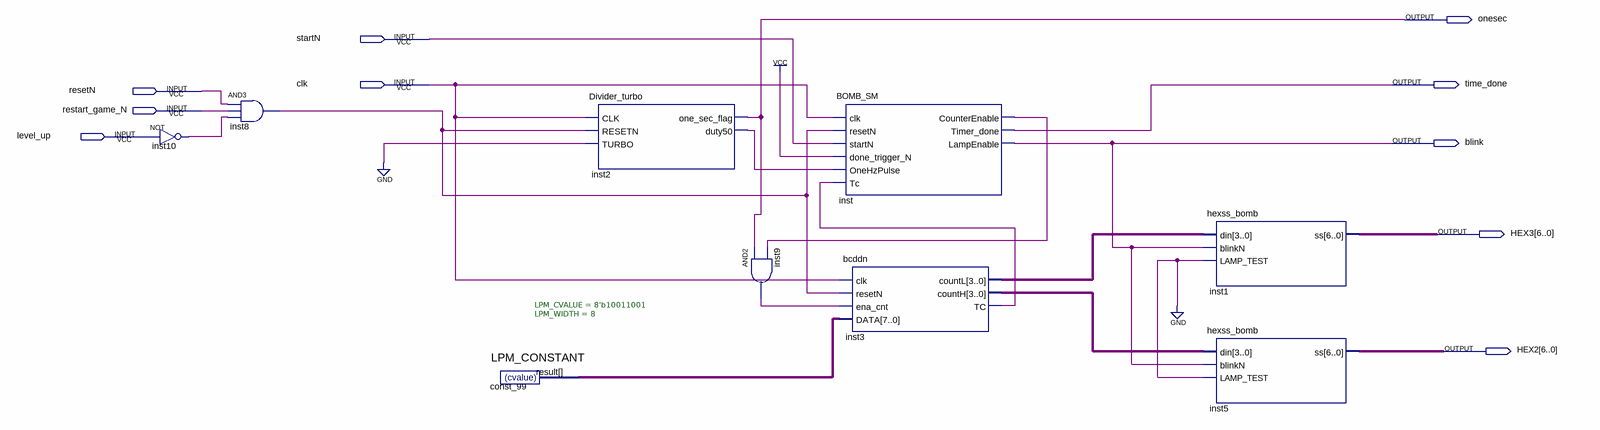
[diagram p0: schematic sheet]
// Quartus schematic BOMB_top.bdf as structural Verilog: 9 symbols, 10 pins
module BOMB_top (
  input  startN,
  input  clk,
  input  resetN,
  input  restart_game_N,
  input  level_up,
  output onesec,
  output time_done,
  output blink,
  output [6:0] HEX3,
  output [6:0] HEX2
);

  wire inst2_duty50, inst3_tc, inst8_out, inst9_out, inst10_out, inst_counterenable;
  wire [3:0] inst3_counth, inst3_countl;
  wire [7:0] const_99_result;

  not inst10 (inst10_out, level_up);
  and inst8 (inst8_out, resetN, restart_game_N, inst10_out);
  LPM_CONSTANT #(.LPM_CVALUE(8'b10011001), .LPM_WIDTH(8)) const_99 (.result(const_99_result));
  Divider_turbo inst2 (.CLK(clk), .RESETN(inst8_out), .TURBO(1'b0), .one_sec_flag(onesec), .duty50(inst2_duty50));
  and inst9 (inst9_out, onesec, inst_counterenable);
  BOMB_SM inst (
    .clk(clk), .resetN(inst8_out), .startN(startN), .done_trigger_N(1'b1), .OneHzPulse(inst2_duty50),
    .Tc(inst3_tc), .CounterEnable(inst_counterenable), .Timer_done(time_done), .LampEnable(blink));
  bcddn inst3 (
    .clk(clk), .resetN(inst8_out), .ena_cnt(inst9_out), .DATA(const_99_result), .countL(inst3_countl),
    .countH(inst3_counth), .TC(inst3_tc));
  hexss_bomb inst1 (.din(inst3_countl), .blinkN(blink), .LAMP_TEST(1'b0), .ss(HEX3));
  hexss_bomb inst5 (.din(inst3_counth), .blinkN(blink), .LAMP_TEST(1'b0), .ss(HEX2));
endmodule
